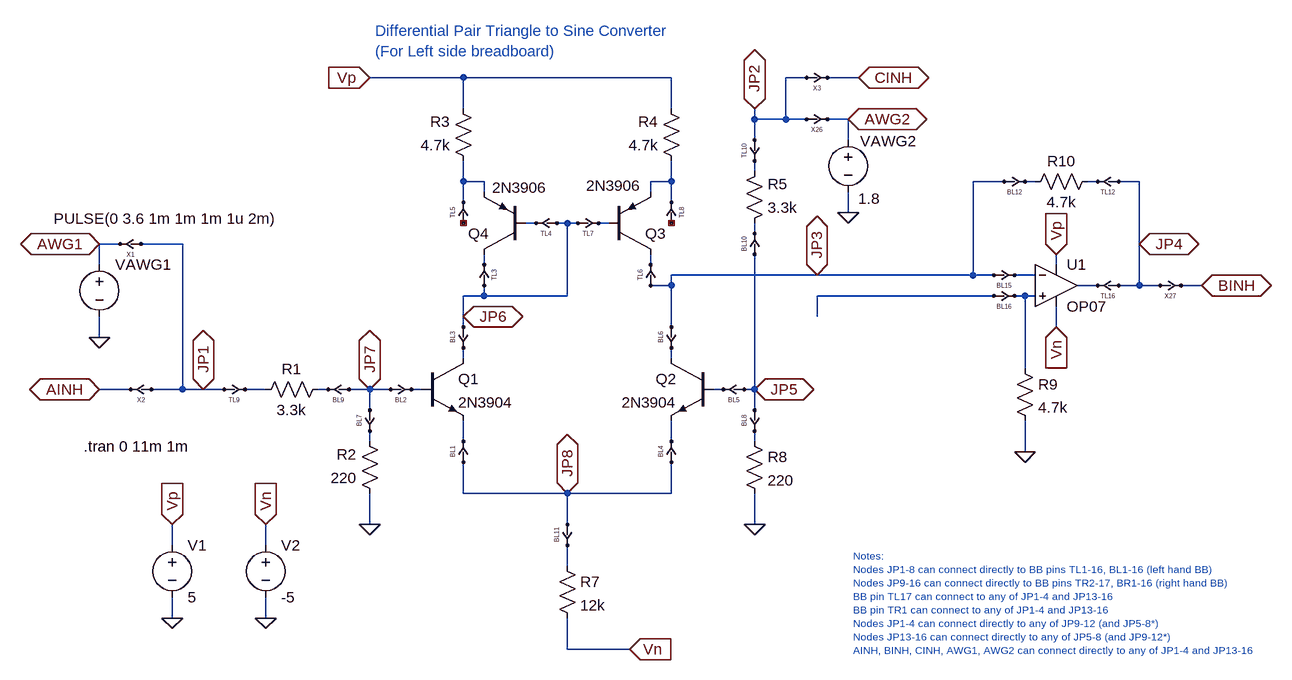
[diagram p0: schematic diffpair_current_mirror_triangle_to_sine.asc]
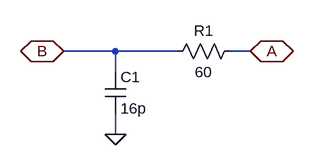
[diagram p1: sub-circuit cross_point.asc]
diffpair_current_mirror_triangle_to_sine.asc, the LTspice schematic file:
Version 4
SHEET 1 880 960
WIRE -544 -144 -688 -144
WIRE -224 -144 -544 -144
WIRE -16 -144 -48 -144
WIRE 64 -144 16 -144
WIRE -544 -96 -544 -144
WIRE -224 -96 -224 -144
WIRE -96 -80 -96 -96
WIRE -48 -80 -48 -144
WIRE -48 -80 -96 -80
WIRE -16 -80 -48 -80
WIRE 48 -80 16 -80
WIRE -96 -48 -96 -80
WIRE 48 -48 48 -80
WIRE -96 0 -96 -16
WIRE -544 16 -544 -16
WIRE -512 16 -544 16
WIRE -224 16 -224 -16
WIRE -224 16 -256 16
WIRE 288 16 240 16
WIRE 336 16 320 16
WIRE 432 16 416 16
WIRE 496 16 464 16
WIRE -512 32 -512 16
WIRE -256 32 -256 16
WIRE -544 48 -544 16
WIRE -224 48 -224 16
WIRE 48 64 48 32
WIRE -432 80 -448 80
WIRE -384 80 -400 80
WIRE -368 80 -384 80
WIRE -320 80 -336 80
WIRE -96 96 -96 80
WIRE -1072 112 -1104 112
WIRE -976 112 -1040 112
WIRE 496 112 496 16
WIRE -1104 144 -1104 112
WIRE -512 144 -512 128
WIRE -256 144 -256 128
WIRE 368 144 368 128
WIRE 0 160 -224 160
WIRE 240 160 240 16
WIRE 240 160 0 160
WIRE 272 160 240 160
WIRE 336 160 304 160
WIRE -224 176 -224 160
WIRE -224 176 -256 176
WIRE 432 176 400 176
WIRE 496 176 496 112
WIRE 496 176 464 176
WIRE 528 176 496 176
WIRE 592 176 560 176
WIRE -512 192 -512 176
WIRE -512 192 -544 192
WIRE -384 192 -384 80
WIRE -384 192 -512 192
WIRE 272 192 0 192
WIRE 320 192 304 192
WIRE 336 192 320 192
WIRE -544 224 -544 192
WIRE 0 224 0 192
WIRE -544 240 -544 224
WIRE -224 240 -224 176
WIRE 368 240 368 208
WIRE -1104 256 -1104 224
WIRE -544 288 -544 272
WIRE -224 288 -224 272
WIRE 320 304 320 192
WIRE -1056 336 -1104 336
WIRE -976 336 -976 112
WIRE -976 336 -1024 336
WIRE -944 336 -976 336
WIRE -912 336 -944 336
WIRE -848 336 -880 336
WIRE -752 336 -768 336
WIRE -688 336 -720 336
WIRE -656 336 -688 336
WIRE -608 336 -624 336
WIRE -144 336 -160 336
WIRE -96 336 -96 128
WIRE -96 336 -112 336
WIRE -688 368 -688 336
WIRE -96 368 -96 336
WIRE -688 416 -688 400
WIRE -544 416 -544 384
WIRE -224 416 -224 384
WIRE -96 416 -96 400
WIRE 320 432 320 384
WIRE -544 496 -544 448
WIRE -384 496 -544 496
WIRE -224 496 -224 448
WIRE -224 496 -384 496
WIRE -688 544 -688 496
WIRE -384 544 -384 496
WIRE -96 544 -96 496
WIRE -992 576 -992 544
WIRE -848 576 -848 544
WIRE -384 608 -384 576
WIRE -992 688 -992 656
WIRE -848 688 -848 656
WIRE -384 736 -384 688
WIRE -288 736 -384 736
FLAG -96 544 0
FLAG 320 432 0
FLAG 368 128 Vp
IOPIN 368 128 In
FLAG 368 240 Vn
IOPIN 368 240 In
FLAG -688 -144 Vp
IOPIN -688 -144 In
FLAG -288 736 Vn
IOPIN -288 736 In
FLAG -688 544 0
FLAG -992 688 0
FLAG -848 688 0
FLAG -992 544 Vp
IOPIN -992 544 In
FLAG -848 544 Vn
IOPIN -848 544 In
FLAG -944 336 JP1
IOPIN -944 336 BiDir
FLAG -1104 112 AWG1
IOPIN -1104 112 BiDir
FLAG -1104 336 AINH
IOPIN -1104 336 BiDir
FLAG -1104 256 0
FLAG -96 -96 JP2
IOPIN -96 -96 BiDir
FLAG 48 -80 AWG2
IOPIN 48 -80 BiDir
FLAG 48 64 0
FLAG -688 336 JP7
IOPIN -688 336 BiDir
FLAG -384 496 JP8
IOPIN -384 496 BiDir
FLAG -544 224 JP6
IOPIN -544 224 BiDir
FLAG 0 160 JP3
IOPIN 0 160 BiDir
FLAG -96 336 JP5
IOPIN -96 336 BiDir
FLAG 592 176 BINH
IOPIN 592 176 BiDir
FLAG 496 112 JP4
IOPIN 496 112 BiDir
FLAG 64 -144 CINH
IOPIN 64 -144 BiDir
SYMBOL npn -608 288 R0
SYMATTR InstName Q1
SYMATTR Value 2N3904
SYMBOL npn -160 288 M0
SYMATTR InstName Q2
SYMATTR Value 2N3904
SYMBOL res -752 320 R90
WINDOW 0 0 56 VBottom 2
WINDOW 3 32 56 VTop 2
SYMATTR InstName R1
SYMATTR Value 3.3k
SYMBOL res -672 512 R180
WINDOW 0 36 76 Left 2
WINDOW 3 36 40 Left 2
SYMATTR InstName R2
SYMATTR Value 220
SYMBOL res -528 0 R180
WINDOW 0 36 76 Left 2
WINDOW 3 36 40 Left 2
SYMATTR InstName R3
SYMATTR Value 4.7k
SYMBOL res -208 0 R180
WINDOW 0 36 76 Left 2
WINDOW 3 36 40 Left 2
SYMATTR InstName R4
SYMATTR Value 4.7k
SYMBOL res -400 592 R0
SYMATTR InstName R7
SYMATTR Value 12k
SYMBOL res -112 400 R0
SYMATTR InstName R8
SYMATTR Value 220
SYMBOL res 304 288 R0
SYMATTR InstName R9
SYMATTR Value 4.7k
SYMBOL res 432 0 R90
WINDOW 0 0 56 VBottom 2
WINDOW 3 32 56 VTop 2
SYMATTR InstName R10
SYMATTR Value 4.7k
SYMBOL voltage -992 560 R0
WINDOW 123 0 0 Left 0
WINDOW 39 0 0 Left 0
SYMATTR InstName V1
SYMATTR Value 5
SYMBOL voltage -848 560 R0
WINDOW 123 0 0 Left 0
WINDOW 39 0 0 Left 0
SYMATTR InstName V2
SYMATTR Value -5
SYMBOL voltage -1104 128 R0
WINDOW 123 0 0 Left 0
WINDOW 39 0 0 Left 0
WINDOW 3 -70 -55 Left 2
SYMATTR Value PULSE(0 3.6 1m 1m 1m 1u 2m)
SYMATTR InstName VAWG1
SYMBOL cross_point -1056 112 M180
SYMATTR InstName X1
SYMBOL cross_point -1040 336 M180
SYMATTR InstName X2
SYMBOL cross_point -896 336 R180
SYMATTR InstName TL9
SYMBOL cross_point -736 336 M180
SYMATTR InstName BL9
SYMBOL cross_point -640 336 R180
SYMATTR InstName BL2
SYMBOL cross_point -688 384 R270
SYMATTR InstName BL7
SYMBOL cross_point -544 432 M90
SYMATTR InstName BL1
SYMBOL cross_point -224 432 M90
SYMATTR InstName BL4
SYMBOL cross_point -128 336 M180
SYMATTR InstName BL5
SYMBOL cross_point -384 560 R270
SYMATTR InstName BL11
SYMBOL cross_point -96 384 R270
SYMATTR InstName BL8
SYMBOL cross_point -544 64 M90
SYMATTR InstName TL5
SYMBOL cross_point -224 64 R90
SYMATTR InstName TL8
SYMBOL cross_point 288 160 R180
SYMATTR InstName BL15
SYMBOL cross_point 288 192 R180
SYMATTR InstName BL16
SYMBOL cross_point 304 16 R180
SYMATTR InstName BL12
SYMBOL cross_point 448 16 M180
SYMATTR InstName TL12
SYMBOL cross_point 448 176 M180
SYMATTR InstName TL16
SYMBOL res -112 96 M180
WINDOW 0 36 76 Left 2
WINDOW 3 36 40 Left 2
SYMATTR InstName R5
SYMATTR Value 3.3k
SYMBOL cross_point -96 -32 R270
SYMATTR InstName TL10
SYMBOL cross_point -96 112 M90
SYMATTR InstName BL10
SYMBOL voltage 48 -64 M0
WINDOW 123 0 0 Left 0
WINDOW 39 0 0 Left 0
WINDOW 0 -105 18 Left 2
WINDOW 3 -49 106 Left 2
SYMATTR InstName VAWG2
SYMATTR Value 1.8
SYMBOL cross_point 0 -80 R180
SYMATTR InstName X26
SYMBOL cross_point 544 176 R180
SYMATTR InstName X27
SYMBOL cross_point 0 -144 R180
SYMATTR InstName X3
SYMBOL cross_point -416 80 M180
SYMATTR InstName TL4
SYMBOL cross_point -512 160 R90
SYMATTR InstName TL3
SYMBOL cross_point -256 160 M90
SYMATTR InstName TL6
SYMBOL cross_point -352 80 R180
SYMATTR InstName TL7
SYMBOL pnp -320 128 M180
WINDOW 0 56 32 Left 2
WINDOW 3 -35 106 Left 2
SYMATTR InstName Q3
SYMATTR Value 2N3906
SYMBOL pnp -448 128 R180
WINDOW 0 56 32 Left 2
WINDOW 3 -33 103 Left 2
SYMATTR InstName Q4
SYMATTR Value 2N3906
SYMBOL cross_point -544 256 R270
SYMATTR InstName BL3
SYMBOL cross_point -224 256 R270
SYMATTR InstName BL6
SYMBOL OpAmps\\OP07 368 112 R0
SYMATTR InstName U1
TEXT -1128 424 Left 2 !.tran 0 11m 1m
TEXT -680 -216 Left 2 ;Differential Pair Triangle to Sine Converter\n(For Left side breadboard)
TEXT 56 592 Left 1 ;Notes:\nNodes JP1-8 can connect directly to BB pins TL1-16, BL1-16 (left hand BB)\nNodes JP9-16 can connect directly to BB pins TR2-17, BR1-16 (right hand BB)\nBB pin TL17 can connect to any of JP1-4 and JP13-16\nBB pin TR1 can connect to any of JP1-4 and JP13-16\nNodes JP1-4 can connect directly to any of JP9-12 (and JP5-8*)\nNodes JP13-16 can connect directly to any of JP5-8 (and JP9-12*)\nAINH, BINH, CINH, AWG1, AWG2 can connect directly to any of JP1-4 and JP13-16

cross_point.asc, the sub-circuit schematic file:
Version 4
SHEET 1 880 680
WIRE 80 160 0 160
WIRE 176 160 80 160
WIRE 288 160 256 160
WIRE 80 192 80 160
WIRE 80 288 80 256
FLAG 288 160 A
IOPIN 288 160 BiDir
FLAG 0 160 B
IOPIN 0 160 BiDir
FLAG 80 288 0
SYMBOL res 272 144 R90
WINDOW 0 0 56 VBottom 2
WINDOW 3 32 56 VTop 2
SYMATTR InstName R1
SYMATTR Value 60
SYMBOL cap 64 192 R0
SYMATTR InstName C1
SYMATTR Value 16p

The netlist it stands for:
* diffpair_current_mirror_triangle_to_sine.asc
Q1 N015 N019 N022 0 2N3904
Q2 N016 N020 N023 0 2N3904
R1 N018 N017 3.3k
R2 0 N021 220
R3 N002 Vp 4.7k
R4 N003 Vp 4.7k
R7 N025 Vn 12k
R8 N024 0 220
R9 N014 0 4.7k
R10 N005 N004 4.7k
V1 Vp 0 5
V2 Vn 0 -5
VAWG1 AWG1 0 PULSE(0 3.6 1m 1m 1m 1u 2m)
XX1 JP1 AWG1 cross_point
XX2 JP1 AINH cross_point
XTL9 JP1 N017 cross_point
XBL9 JP7 N018 cross_point
XBL2 JP7 N019 cross_point
XBL7 JP7 N021 cross_point
XBL1 JP8 N022 cross_point
XBL4 JP8 N023 cross_point
XBL5 JP5 N020 cross_point
XBL11 JP8 N025 cross_point
XBL8 JP5 N024 cross_point
XTL5 NC_01 N002 cross_point
XTL8 NC_02 N003 cross_point
XBL15 JP3 N011 cross_point
XBL16 N013 N014 cross_point
XBL12 JP3 N004 cross_point
XTL12 JP4 N005 cross_point
XTL16 JP4 N012 cross_point
R5 N008 N001 3.3k
XTL10 JP2 N001 cross_point
XBL10 JP5 N008 cross_point
VAWG2 AWG2 0 1.8
XX26 JP2 AWG2 cross_point
XX27 JP4 BINH cross_point
XX3 JP2 CINH cross_point
XTL4 JP6 N006 cross_point
XTL3 JP6 N009 cross_point
XTL6 JP3 N010 cross_point
XTL7 JP6 N007 cross_point
Q3 N010 N007 N003 0 2N3906
Q4 N009 N006 N002 0 2N3906
XBL3 JP6 N015 cross_point
XBL6 JP3 N016 cross_point
XU1 N014 N011 Vp Vn N012 LT1001  ; OP07, pins In+ In- V+ V- OUT

* block symbol definitions
.subckt cross_point A B
R1 A B 60
C1 B 0 16p
.ends cross_point

.model NPN NPN
.model PNP PNP
.lib standard.bjt
.tran 0 11m 1m
* Differential Pair Triangle to Sine Converter
* (For Left side breadboard)
* Notes:
* Nodes JP1-8 can connect directly to BB pins TL1-16, BL1-16 (left hand BB)
* Nodes JP9-16 can connect directly to BB pins TR2-17, BR1-16 (right hand BB)
* BB pin TL17 can connect to any of JP1-4 and JP13-16
* BB pin TR1 can connect to any of JP1-4 and JP13-16
* Nodes JP1-4 can connect directly to any of JP9-12 (and JP5-8*)
* Nodes JP13-16 can connect directly to any of JP5-8 (and JP9-12*)
* AINH, BINH, CINH, AWG1, AWG2 can connect directly to any of JP1-4 and JP13-16
.lib LTC.lib
.backanno
.end